# EAGLE design Shield (EAGLE 7.4.0)
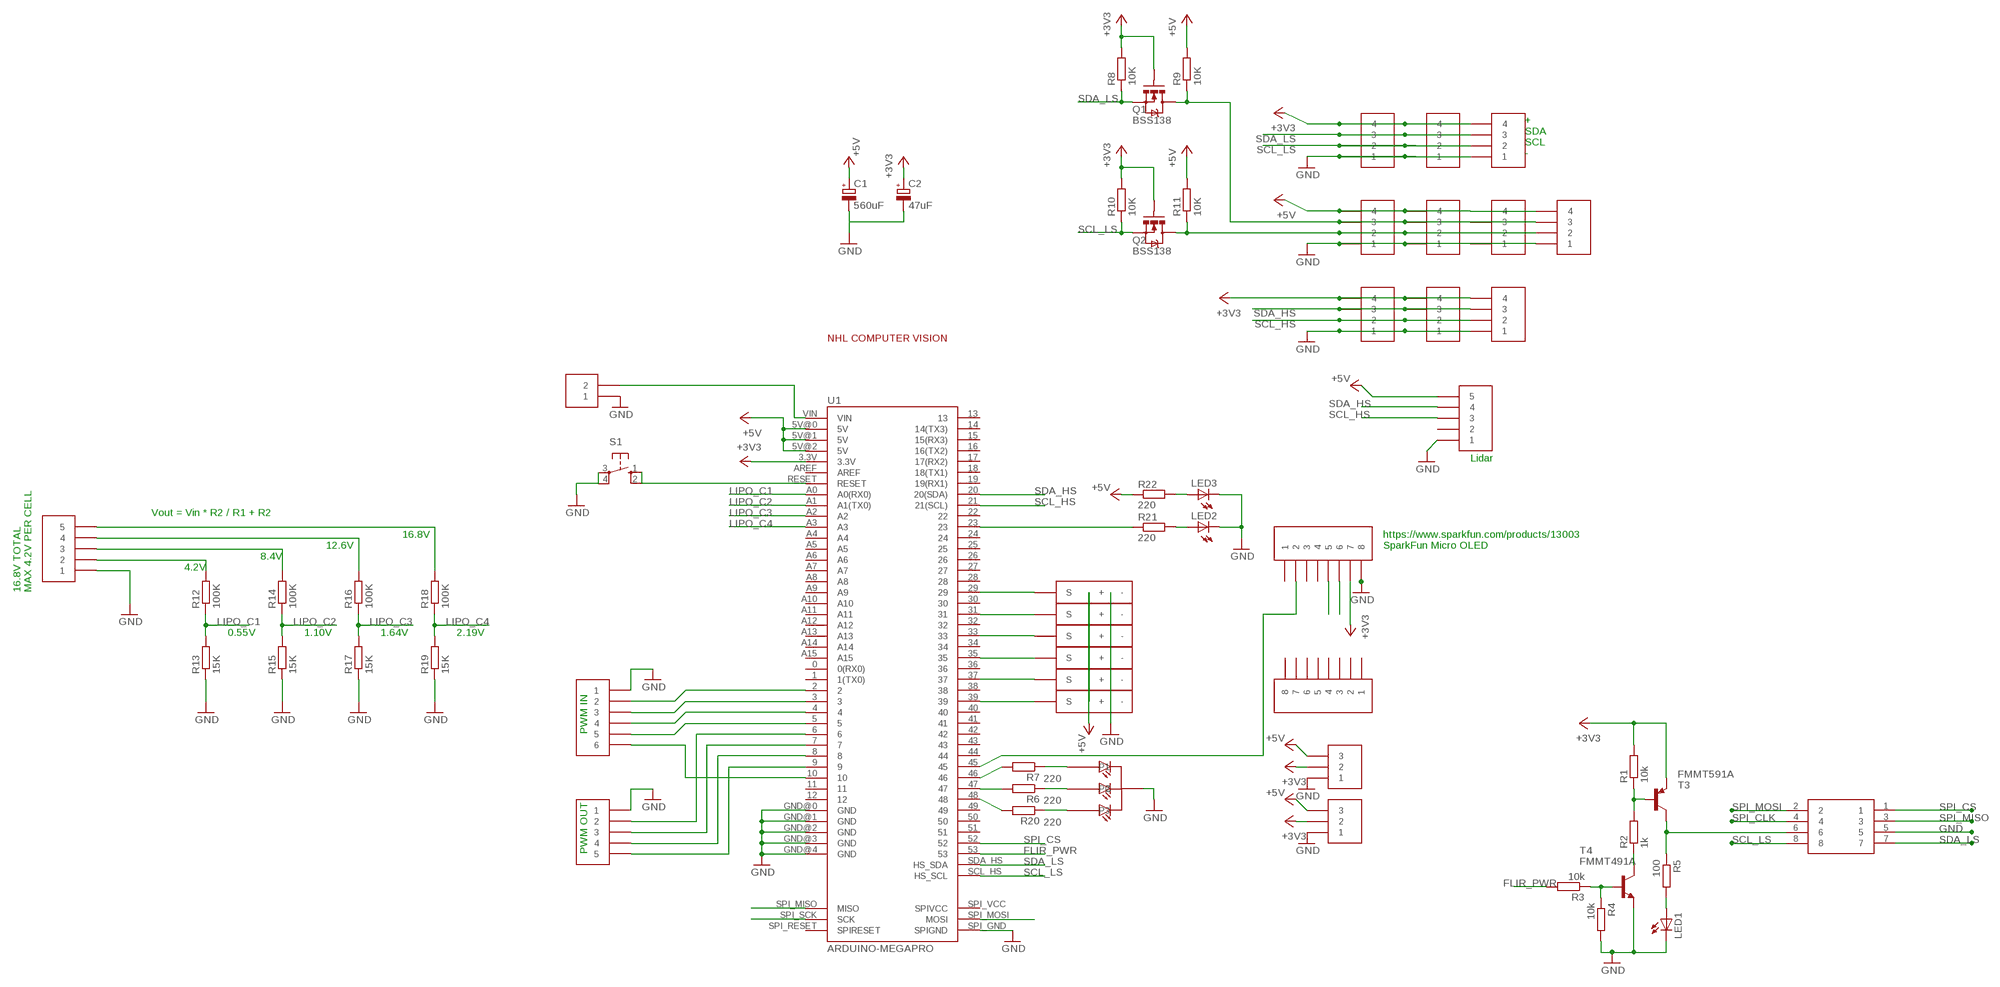
[diagram p0: schematic, sheet 1]

## Parts
C1  560uF  CPOL-EU153CLV-1010  [153CLV-1010]
C2  47uF  CPOL-EU153CLV-0605  [153CLV-0605]
LED1  LEDSML0805  [SML0805]
LED2  LEDSML0805  [SML0805]
LED3  LEDSML0805  [SML0805]
Q1  BSS138  MOSFET-NCHANNELBSS138  [SOT23-3]
Q2  BSS138  MOSFET-NCHANNELBSS138  [SOT23-3]
R1  10k  R-EU_R0805  [R0805]
R2  1k  R-EU_R0805  [R0805]
R3  10k  R-EU_R0805  [R0805]
R4  10k  R-EU_R0805  [R0805]
R5  100  R-EU_R0805  [R0805]
R6  220  R-EU_R0805  [R0805]
R7  220  R-EU_R0805  [R0805]
R8  10K  R-EU_R0805  [R0805]
R9  10K  R-EU_R0805  [R0805]
R10  10K  R-EU_R0805  [R0805]
R11  10K  R-EU_R0805  [R0805]
R12  100K  R-EU_R0805  [R0805]
R13  15K  R-EU_R0805  [R0805]
R14  100K  R-EU_R0805  [R0805]
R15  15K  R-EU_R0805  [R0805]
R16  100K  R-EU_R0805  [R0805]
R17  15K  R-EU_R0805  [R0805]
R18  100K  R-EU_R0805  [R0805]
R19  15K  R-EU_R0805  [R0805]
R20  220  R-EU_R0805  [R0805]
R21  220  R-EU_R0805  [R0805]
R22  220  R-EU_R0805  [R0805]
S1  10-XX  [B3F-10XX]
T3  FMMT591A  -PNP-SOT23-BCE  [SOT23-BCE]
T4  FMMT491A  BC808-NPN-SOT23-BEC  [SOT23-BEC]
U1  ARDUINO-MEGAPRO  [ARDUINO_MEGA-PRO-3.3V]
U$1  RGB5MMRGB5MM  [RGB5MM]
U$2  JST-4  [JST-4]
U$3  JST-4  [JST-4]
U$4  JST-4  [JST-4]
U$5  JST-4  [JST-4]
U$6  JST-4  [JST-4]
U$7  JST-4  [JST-4]
U$8  JST-4  [JST-4]
U$9  JST-4  [JST-4]
U$10  JST-4  [JST-4]
U$11  JST-4  [JST-4]
U$12  LIDAR  JST-5  [JST-5]
U$13  LIDAR  JST-5  [JST-5]
U$14  JST-3  [JST-3]
U$15  JST-3  [JST-3]
U$16  JST-2  [JST-2]
U$17  JST-6  [JST-6]
U$18  JST-5  [JST-5]
U$19  SERVOHEADER  [SERVOHEADER]
U$20  SERVOHEADER  [SERVOHEADER]
U$21  SERVOHEADER  [SERVOHEADER]
U$22  SERVOHEADER  [SERVOHEADER]
U$23  SERVOHEADER  [SERVOHEADER]
U$24  SERVOHEADER  [SERVOHEADER]
U$25  IDC-8WAY  [IDC-8WAY]
U$26  OLEDHEADER  [OLEDHEADER]
U$27  OLEDHEADER  [OLEDHEADER]
U$28  NHLLOGO  [NHLLOGO]

## Nets
+3V3: C2.+ Q1.1(G) Q2.1(G) R1.2 R8.2 R10.2 T3.E U1.3.3V U$2.4 U$3.4 U$4.4 U$8.4 U$9.4 U$10.4 U$14.2 U$15.2 U$26.P$7
+5V: C1.+ R9.2 R11.2 R22.1 U1.5V@0(5V) U1.5V@1(5V) U1.5V@2(5V) U$5.4 U$6.4 U$7.4 U$11.4 U$12.5 U$14.3 U$15.3 U$19.+ U$20.+ U$21.+ U$22.+ U$23.+ U$24.+
FLIR_PWR: R3.2 U1.53
GND: C1.- C2.- LED1.C LED2.C LED3.C R4.2 R13.1 R15.1 R17.1 R19.1 S1.3(P) S1.4(P1) T4.E U1.GND@0(GND) U1.GND@1(GND) U1.GND@2(GND) U1.GND@3(GND) U1.GND@4(GND) U1.SPI_GND(SPIGND) U$1.C U$2.1 U$3.1 U$4.1 U$5.1 U$6.1 U$7.1 U$8.1 U$9.1 U$10.1 U$11.1 U$12.1 U$13.1 U$14.1 U$15.1 U$16.1 U$17.1 U$18.1 U$19.- U$20.- U$21.- U$22.- U$23.- U$24.- U$25.5 U$26.P$8
LIPO_C1: R12.1 R13.2 U1.A0(A0(RX0))
LIPO_C2: R14.1 R15.2 U1.A1(A1(TX0))
LIPO_C3: R16.1 R17.2 U1.A2
LIPO_C4: R18.1 R19.2 U1.A3
N$1: R1.1 R2.2 T3.B
N$2: R2.1 T4.C
N$3: R3.1 R4.1 T4.B
N$4: LED1.A R5.2
N$5: U1.5 U$17.5
N$6: U1.4 U$17.4
N$7: R12.2 U$13.2
N$8: U1.3 U$17.3
N$9: U1.2 U$17.2
N$10: R14.2 U$13.3
N$11: R16.2 U$13.4
N$12: R18.2 U$13.5
N$13: U1.10 U$17.6
N$14: R20.2 U1.48
N$15: R6.2 U1.47
N$16: U1.6 U$18.2
N$17: U1.7 U$18.3
N$18: U1.8 U$18.4
N$19: U1.9 U$18.5
N$20: R7.2 U1.46
N$21: R20.1 U$1.P3
N$22: R6.1 U$1.P2
N$23: R7.1 U$1.P1
N$24: U1.45 U$26.P$2
N$25: U1.35 U$21.S
N$26: U1.33 U$22.S
N$27: U1.31 U$23.S
N$28: U1.39 U$19.S
N$29: U1.37 U$20.S
N$30: LED2.A R21.2
N$32: R21.1 U1.23
N$33: LED3.A R22.2
N$34: S1.1(S) S1.2(S1) U1.RESET
N$35: U1.VIN U$16.2
N$36: U1.29 U$24.S
SCL_HS: U1.21(21(SCL)) U$8.2 U$9.2 U$10.2 U$12.3
SCL_LS: Q2.2(S) R10.1 U1.SCL_HS(HS_SCL) U$2.2 U$3.2 U$4.2 U$25.8 U$26.P$5
SCL_LS_5: Q2.3(D) R11.1 U$5.2 U$6.2 U$7.2 U$11.2
SDA_HS: U1.20(20(SDA)) U$8.3 U$9.3 U$10.3 U$12.4
SDA_LS: Q1.2(S) R8.1 U1.SDA_HS(HS_SDA) U$2.3 U$3.3 U$4.3 U$25.7 U$26.P$6
SDA_LS_5: Q1.3(D) R9.1 U$5.3 U$6.3 U$7.3 U$11.3
SPI_CLK: U1.SPI_SCK(SCK) U$25.4
SPI_CS: U1.52 U$25.1
SPI_MISO: U1.SPI_MISO(MISO) U$25.3
SPI_MOSI: U1.SPI_MOSI(MOSI) U$25.2
SPI_VIN: R5.1 T3.C U$25.6
Unconnected: U1.0(0(RX0)) U1.1(1(TX0)) U1.11 U1.12 U1.13 U1.14(14(TX3)) U1.15(15(RX3)) U1.16(16(TX2)) U1.17(17(RX2)) U1.18(18(TX1)) U1.19(19(RX1)) U1.22 U1.24 U1.25 U1.26 U1.27 U1.28 U1.30 U1.32 U1.34 U1.36 U1.38 U1.40 U1.41 U1.42 U1.43 U1.44 U1.49 U1.50 U1.51 U1.A4 U1.A5 U1.A6 U1.A7 U1.A8 U1.A9 U1.A10 U1.A11 U1.A12 U1.A13 U1.A14 U1.A15 U1.AREF U1.SPI_RESET(SPIRESET) U1.SPI_VCC(SPIVCC) U$12.2 U$26.P$1 U$26.P$3 U$26.P$4 U$27.P$1 U$27.P$2 U$27.P$3 U$27.P$4 U$27.P$5 U$27.P$6 U$27.P$7 U$27.P$8

## Notes on the sheet
- +
- SDA
- SCL
- -
- Lidar
- Vout = Vin * R2 / R1 + R2
- 16.8V | https://www.sparkfun.com/products/13003
- 12.6V | SparkFun Micro OLED
- 8.4V
- 4.2V
- 16.8V TOTAL | MAX 4.2V PER CELL
- 0.55V | 1.10V | 1.64V | 2.19V
- PWM IN
- PWM OUT

## Library data of the parts
C1 C2 = resistor:CPOL-EU: POLARIZED CAPACITOR, European symbol
LED1-LED3 = led:LED: LED OSRAM: - CHIPLED LG R971, LG N971, LY N971, LG Q971, LY Q971, LO R971, LY R971 LH N974, LH R974 LS Q976, LO Q976, LY Q976 LO Q996 - Hyper CHIPLED LW Q18S LB Q993, LB Q99A, LB R99A - SideLED LS A670, LO A670, LY A670, LG A670, LP A670 LB A673, LV A673, LT A673, LW A673 LH A674 LY A675 LS A676, LA A676, LO A676, LY A676, LW A676 LS A679, LY A679, LG A679 - Hyper Micro SIDELED® LS Y876, LA Y876, LO Y876, LY Y876 LT Y87S - SmartLED LW L88C, LW L88S LB L89C, LB L89S, LG L890 LS L89K, LO L89K, LY L89K LS L896, LA L896, LO L896, LY L896 - TOPLED LS T670, LO T670, LY T670, LG T670, LP T670 LSG T670, LSP T670, LSY T670, LOP T670, LYG T670 LG T671, LOG T671, LSG T671 LB T673, LV T673, LT T673, LW T673 LH T674 LS T676, LA T676, LO T676, LY T676, LB T676, LH T676, LSB T676, LW T676 LB T67C, LV T67C, LT T67C, LS T67K, LO T67K, LY T67K, LW E67C LS E67B, LA E67B, LO E67B, LY E67B, LB E67C, LV E67C, LT E67C LW T67C LS T679, LY T679, LG T679 LS T770, LO T770, LY T770, LG T770, LP T770 LB T773, LV T773, LT T773, LW T773 LH T774 LS E675, LA E675, LY E675, LS T675 LS T776, LA T776, LO T776, LY T776, LB T776 LHGB T686 LT T68C, LB T68C - Hyper Mini TOPLED® LB M676 - Mini TOPLED Santana® LG M470 LS M47K, LO M47K, LY M47K Source: http://www.osram.convergy.de LUXEON: - LUMILED® LXK2-PW12-R00, LXK2-PW12-S00, LXK2-PW14-U00, LXK2-PW14-V00 LXK2-PM12-R00, LXK2-PM12-S00, LXK2-PM14-U00 LXK2-PE12-Q00, LXK2-PE12-R00, LXK2-PE12-S00, LXK2-PE14-T00, LXK2-PE14-U00 LXK2-PB12-K00, LXK2-PB12-L00, LXK2-PB12-M00, LXK2-PB14-N00, LXK2-PB14-P00, LXK2-PB14-Q00 LXK2-PR12-L00, LXK2-PR12-M00, LXK2-PR14-Q00, LXK2-PR14-R00 LXK2-PD12-Q00, LXK2-PD12-R00, LXK2-PD12-S00 LXK2-PH12-R00, LXK2-PH12-S00 LXK2-PL12-P00, LXK2-PL12-Q00, LXK2-PL12-R00 Source: www.luxeon.com KINGBRIGHT: KA-3528ASYC Source: www.kingbright.com
Q1 Q2 = SparkFun-DiscreteSemi:MOSFET-NCHANNEL: Common NMOSFET Parts MFG P/N Store ID Prod ID FDD8780 TRANS-09984 SI7820DN TRANS-11055 FDS6630A IC-08089 2N7002PW TRANS-11151 FQP30N06L COM-10213 TRANS-10060 BSS123LT1G TRANS-08345 BSS138 TRANS-00830 BS170 2N7000; PROD_ID: TRANS-00830; VALUE: 200mA/50V
R1-R22 = resistor:R-EU_: RESISTOR, European symbol
S1 = switch-omron:10-XX: OMRON SWITCH; MPN: B3F-1000; OC_FARNELL: 176432; OC_NEWARK: 36M3542
T3 = transistor:*-PNP-: PNP Transistror
T4 = transistor:*-NPN-: NPN Transistror BF959 corrected 2008.03.06
U1 = Arduino-Boards:ARDUINO-MEGA: Arduino Mega board footprint
U$1 = Arduino-Boards:RGB5MM
U$2-U$11 = Arduino-Boards:JST-4
U$12 U$13 U$18 = Arduino-Boards:JST-5
U$14 U$15 = Arduino-Boards:JST-3
U$16 = Arduino-Boards:JST-2
U$17 = Arduino-Boards:JST-6
U$19-U$24 = Arduino-Boards:SERVOHEADER
U$25 = Arduino-Boards:IDC-8WAY
U$26 U$27 = Arduino-Boards:OLEDHEADER
U$28 = Arduino-Boards:NHLLOGO

## Board
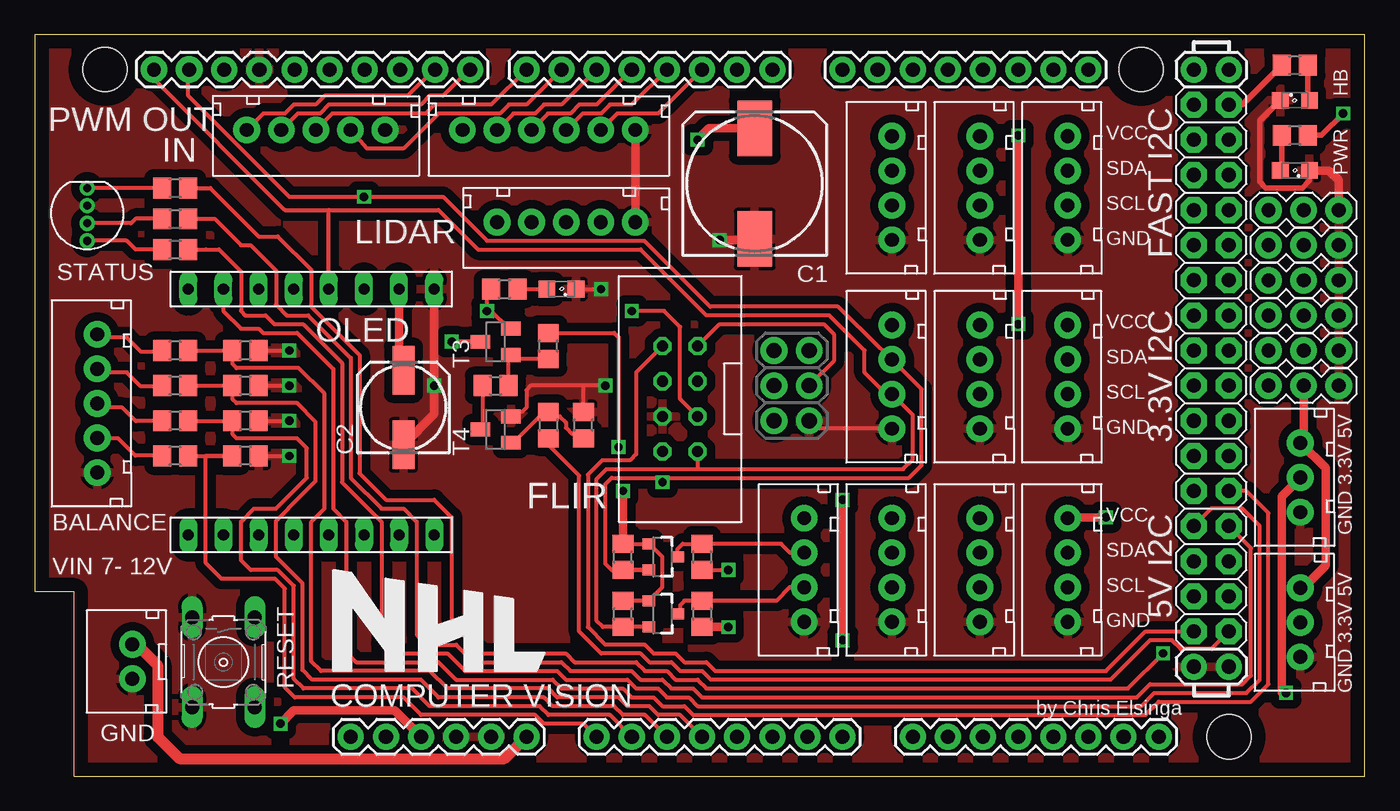
[diagram p1: board, top side]
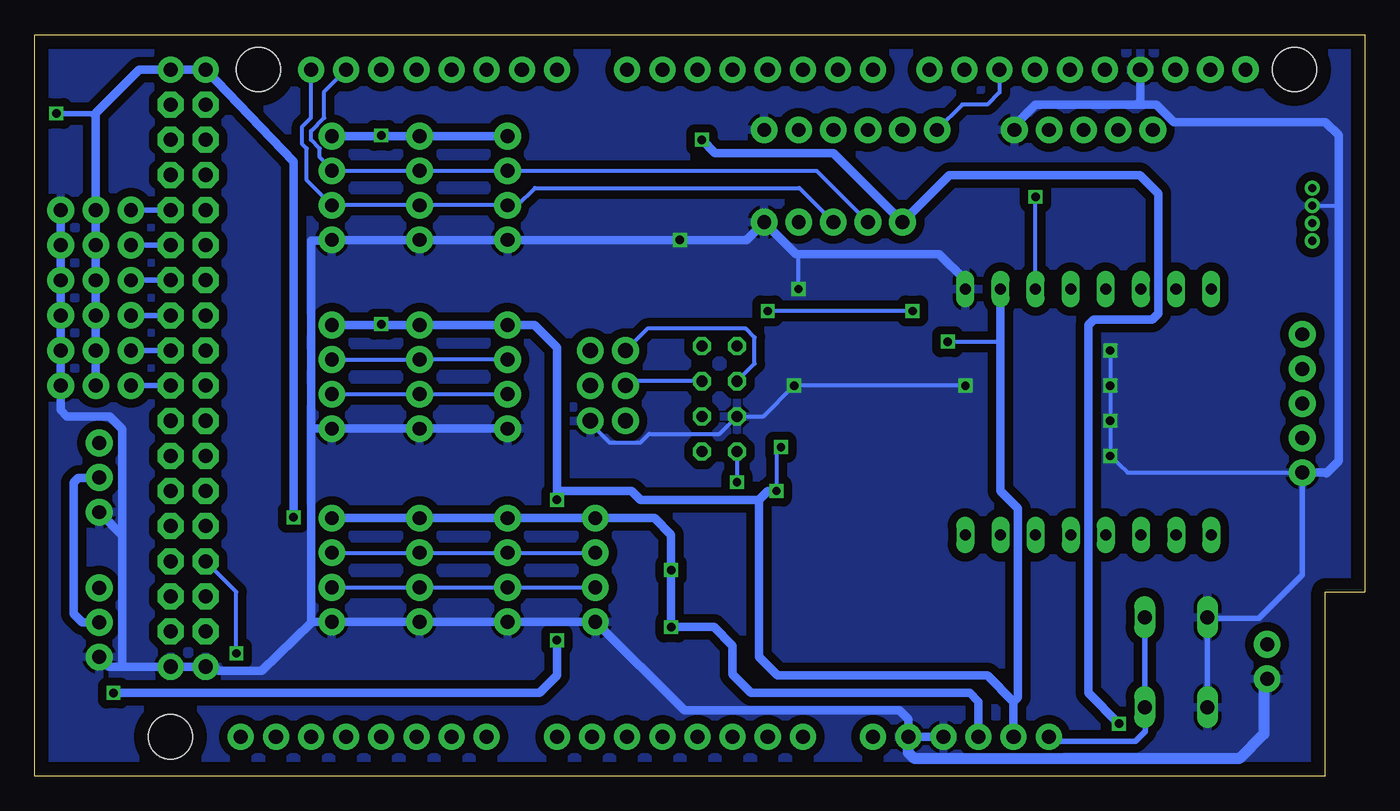
[diagram p2: board, bottom side, seen from below]

Size 96.19 x 53.65 mm. Coordinates in mm from the lower left corner, seen from the top.
Outline: 2.86,0 96.19,0 96.19,53.65 0,53.65 0,13.34 2.86,13.34 2.86,0
Copper layers (1*16): Top 0.035mm / dielectric 1.5mm / Bottom 0.035mm
Design rules "default *": minimum track width 10mil, minimum drill 20mil, track to track 8mil, track to pad 8mil, pad to pad 8mil, via to via 8mil, smd to smd 8mil, copper to edge 40mil, drill to drill 8mil, minimum pad ring 10mil, minimum via ring 8mil, stop-mask expansion 4mil, vias tented up to drill 0mil, thermal gap 10mil

### Footprints (pad centres in the part's own frame; a part is rotated, then mirrored left to right if it is on the bottom)
153CLV-1010 = smd 4 x 2.5: + 4,0; - -4,0
153CLV-0605 = smd 3.5 x 1.6: + 2.7,0; - -2.7,0
SML0805 = smd 1.2 x 1.2: A 1.05,0; C -1.05,0
SOT23-3 = smd 0.8 x 0.9: 1 -0.95,-1; 2 0.95,-1; 3 0,1.1
R0805 = smd 1.3 x 1.5: 1 -0.95,0; 2 0.95,0
B3F-10XX = drill 1.016 long: 1 -3.251,2.261; 2 3.251,2.261; 3 -3.251,-2.261; 4 3.251,-2.261
SOT23-BCE = smd 1 x 1.4: B -0.95,-1.1; C 0.95,-1.1; E 0,1.1
SOT23-BEC = smd 1 x 1.4: B -0.95,-1.1; C 0,1.1; E 0.95,-1.1
ARDUINO_MEGA-PRO-3.3V = drill 1.016 pad 1.88: 0 52.07,50.8; 1 49.53,50.8; 2 46.99,50.8; 3 44.45,50.8; 3.3V 24.13,2.54; 4 41.91,50.8; 5 39.37,50.8; 5V@0 26.67,2.54; 5V@1 82.55,50.8; 5V@2 85.09,50.8; 6 36.83,50.8; 7 34.29,50.8; 8 30.226,50.8; 9 27.686,50.8; 10 25.146,50.8; 11 22.606,50.8; 12 20.066,50.8; 13 17.526,50.8; 14 57.15,50.8; 15 59.69,50.8; 16 62.23,50.8; 17 64.77,50.8; 18 67.31,50.8; 19 69.85,50.8; 20 72.39,50.8; 21 74.93,50.8; A0 39.37,2.54; A1 41.91,2.54; A2 44.45,2.54; A3 46.99,2.54; A4 49.53,2.54; A5 52.07,2.54; A6 54.61,2.54; A7 57.15,2.54; A8 62.23,2.54; A9 64.77,2.54; A10 67.31,2.54; A11 69.85,2.54; A12 72.39,2.54; A13 74.93,2.54; A14 77.47,2.54; A15 80.01,2.54; AREF 12.446,50.8; GND@0 29.21,2.54; GND@1 31.75,2.54; GND@2 82.55,7.62; GND@3 85.09,7.62; GND@4 14.986,50.8; RESET 21.59,2.54; VIN 34.29,2.54 | drill 1.016 pad 1.88 octagon: 22 82.55,48.26; 23 85.09,48.26; 24 82.55,45.72; 25 85.09,45.72; 26 82.55,43.18; 27 85.09,43.18; 28 82.55,40.64; 29 85.09,40.64; 30 82.55,38.1; 31 85.09,38.1; 32 82.55,35.56; 33 85.09,35.56; 34 82.55,33.02; 35 85.09,33.02; 36 82.55,30.48; 37 85.09,30.48; 38 82.55,27.94; 39 85.09,27.94; 40 82.55,25.4; 41 85.09,25.4; 42 82.55,22.86; 43 85.09,22.86; 44 82.55,20.32; 45 85.09,20.32; 46 82.55,17.78; 47 85.09,17.78; 48 82.55,15.24; 49 85.09,15.24; 50 82.55,12.7; 51 85.09,12.7; 52 82.55,10.16; 53 85.09,10.16 | drill 1 pad 1.93: SCL_HS 7.366,50.8; SDA_HS 9.906,50.8 | drill 1.1 pad 1.93: SPI_GND 54.737,25.4; SPI_MISO 52.197,30.48; SPI_MOSI 54.737,27.94; SPI_RESET 52.197,25.4; SPI_SCK 52.197,27.94; SPI_VCC 54.737,30.48 | hole 3.2: 3.81,50.8; 78.74,50.8; 85.09,2.54
RGB5MM = drill 0.6: C 1.27,0; P1 -1.27,0; P2 0,0; P3 2.54,0
JST-4 = drill 1 pad 1.93: 1 -3.75,-0.4; 2 -1.25,-0.4; 3 1.25,-0.4; 4 3.75,-0.4
JST-5 = drill 1 pad 1.93: 1 -3.75,-0.4; 2 -1.25,-0.4; 3 1.25,-0.4; 4 3.75,-0.4; 5 6.25,-0.4
JST-3 = drill 1 pad 1.93: 1 -3.75,-0.4; 2 -1.25,-0.4; 3 1.25,-0.4
JST-2 = drill 1 pad 1.93: 1 -3.75,-0.4; 2 -1.25,-0.4
JST-6 = drill 1 pad 1.93: 1 -3.75,-0.4; 2 -1.25,-0.4; 3 1.25,-0.4; 4 3.75,-0.4; 5 6.25,-0.4; 6 8.75,-0.4
SERVOHEADER = drill 1 pad 1.93: + 0,0; - 2.54,0; S -2.54,0
IDC-8WAY = drill 0.8 octagon: 1 -1.27,3.81; 2 1.27,3.81; 3 -1.27,1.27; 4 1.27,1.27; 5 -1.27,-1.27; 6 1.27,-1.27; 7 -1.27,-3.81; 8 1.27,-3.81
OLEDHEADER = drill 0.8 long: P$1 -8.89,1.27; P$2 -6.35,1.27; P$3 -3.81,1.27; P$4 -1.27,1.27; P$5 1.27,1.27; P$6 3.81,1.27; P$7 6.35,1.27; P$8 8.89,1.27

### Placement (x,y rotation side)
C1  52.07,42.86 90 top
C2  26.67,26.67 90 top
LED1  38.1,35.24 180 top
LED2  91.12,48.9 0 top
LED3  91.12,43.82 180 top
Q1  45.4,15.88 270 top
Q2  45.4,11.75 270 top
R1  37.15,31.11 90 top
R2  33.34,28.26 0 top
R3  37.15,25.4 270 top
R4  39.69,25.4 90 top
R5  33.97,35.24 0 top
R6  10.16,40.32 0 top
R7  10.16,38.1 0 top
R8  42.55,15.88 90 top
R9  48.26,15.88 270 top
R10  42.55,11.75 90 top
R11  48.26,11.75 270 top
R12  10.16,23.18 180 top
R13  15.24,23.18 180 top
R14  10.16,25.72 180 top
R15  15.24,25.72 180 top
R16  10.16,28.26 180 top
R17  15.24,28.26 180 top
R18  10.16,30.8 180 top
R19  15.24,30.8 180 top
R20  10.16,42.55 0 top
R21  91.12,51.44 0 top
R22  91.12,46.36 180 top
S1  13.65,8.26 270 top
T3  33.34,31.43 90 top
T4  33.34,25.08 90 top
U1  1.27,0.32 0 top
U$1  3.81,40.01 90 top
U$2  74.3,28.89 90 top
U$3  67.94,28.89 90 top
U$4  61.6,28.89 90 top
U$5  74.3,14.92 90 top
U$6  67.94,14.92 90 top
U$7  61.6,14.92 90 top
U$8  74.3,42.55 90 top
U$9  67.94,42.55 90 top
U$10  61.6,42.55 90 top
U$11  55.25,14.92 90 top
U$12  39.69,39.69 180 top
U$13  4.13,25.72 90 top
U$14  91.12,22.86 90 top
U$15  91.12,12.38 90 top
U$16  6.67,10.79 90 top
U$17  39.69,46.36 180 top
U$18  21.59,46.36 180 top
U$19  91.76,28.26 0 top
U$20  91.76,30.8 0 top
U$21  91.76,33.34 0 top
U$22  91.76,35.88 0 top
U$23  91.76,38.42 0 top
U$24  91.76,40.96 0 top
U$25  46.67,27.3 0 top
U$26  20,33.97 0 top
U$27  20,18.73 180 top
U$28  21.59,14.92 0 top

### Tracks (layer width: path | path; a pad name or v marks a point on that pad's centre or on a via)
+3V3  (via drill 0.6)
  Top 0.305: R8.2 Q1.1 44.45,16.83 45.4,15.87 45.4,13.7 Q2.1 R10.2 | R1.2 41.91,32.06 42.23,31.75 v42.23,23.81 | T3.E v30.16,31.43
  Top 0.61: v71.12,32.7 v71.12,46.36 | R8.2 v42.55,20.64 | U$14.2 90.17,20.26 90.17,6.03 v90.49,6.03 | v58.42,9.84 v58.42,20 | C2.+ 26.35,30.32 U$26.P$7
  Bottom 0.305: v42.23,23.81 42.55,23.49 v42.55,20.64 | v30.16,31.43 26.35,31.43 26.35,31.75
  Bottom 0.61: U1.3.3V 25.4,5.4 | 25.4,5.4 27.3,7.3 42.47,7.3 43.82,8.65 43.82,20 | U$8.4 71.12,46.29 | 71.12,46.29 U$9.4 U$10.4 | 71.12,32.64 U$3.4 U$4.4 60.04,32.64 58.42,31.02 58.42,20.64 | U$2.4 71.12,32.64 | 71.12,32.64 v71.12,32.7 | v71.12,46.36 71.12,46.29 | v42.55,20.64 43.18,20.64 43.82,20 | 43.82,20 52.39,20 53.02,20.64 58.42,20.64 | U$26.P$7 26.35,31.75 26.35,20.64 25.08,19.37 25.08,5.71 25.4,5.4 | U$14.2 91.54,21.59 93.03,21.59 93.34,21.27 93.34,11.75 92.73,11.13 U$15.2 | v90.49,6.03 59.69,6.03 58.42,7.3 v58.42,9.84 | v58.42,20 58.42,20.64
+5V  (via drill 0.6)
  Top 0.305: R11.2 | R9.2 49.53,14.92 v50.17,14.92
  Top 0.406: R22.1 93.03,46.36 v94.61,47.94
  Top 0.61: v77.47,18.73 74.75,18.73 U$5.4 | v17.78,3.81 18.73,4.76 26.04,4.76 U1.5V@0 | U$15.3 91.52,13.42 93.34,15.24 93.34,22.29 U$14.3 91.76,24.11 U$19.+ | R11.2 v50.16,10.8 v50.17,10.79 | C1.+ 48.77,46.86 v47.94,46.04
  Bottom 0.305: U$7.4 61.91,18.67
  Bottom 0.406: v94.61,47.94 92.08,47.94 91.76,47.62
  Bottom 0.61: U1.5V@0 27.94,5.4 28.57,6.03 44.37,6.03 45.72,7.38 45.72,9.45 47.07,10.79 v50.17,10.79 v50.17,14.92 50.17,17.46 51.38,18.67 U$11.4 61.91,18.67 | v77.47,18.73 77.47,44.45 U1.5V@1 U1.5V@2 88.61,51.12 91.76,47.97 91.76,47.62 U$24.+ U$23.+ U$22.+ U$21.+ U$20.+ U$19.+ | U$5.4 U$6.4 U$7.4 | v17.78,3.81 20,6.03 20,32.63 19.61,33.02 15.37,33.02 14.92,33.47 14.92,42.15 16.27,43.5 30.03,43.5 U$12.5 38.44,45.08 46.99,45.08 v47.94,46.04
FLIR_PWR
  Top 0.305: R3.2 37.15,23.98 39.14,21.99 39.37,21.76 39.37,10.48 40.96,8.89 43.82,8.89 44.45,8.26 46.04,8.26 46.67,7.62 48.26,7.62 48.9,6.99 77.79,6.99 80.64,9.84 82.23,9.84 82.87,9.21 85.09,9.21 U1.53
GND  (via drill 0.6)
  Top 0.305: 39.69,28.26 35.88,28.26 35.56,27.94 35.56,26.67 35.24,26.35 34.44,26.35 T4.E | R4.2 39.69,28.26 | R13.1 v18.41,23.18 | R15.1 v18.41,25.72 | R17.1 v18.41,28.26 | R19.1 v18.41,30.8 | U$4.1 56.58,25.14 U1.SPI_GND | v41.28,28.26 39.69,28.26 | LED1.C v40.96,35.24
  Top 0.406: LED3.C 92.17,43.07 91.65,42.54 89.03,42.54 88.58,42.99 88.58,47.4 LED2.C
  Top 0.61: U$24.- 94.3,43.11 93.59,43.82 LED3.C | C2.- 28.89,26.19 v28.89,28.26 U$26.P$8 | C1.- 52,38.79 v49.53,38.79 | U$17.1 U$12.1
  Bottom 0.305: v18.41,30.8 v18.41,28.26 v18.41,25.72 v18.41,23.18 17.14,21.97 U$13.1 | U$1.C 1.91,41.28 | U1.SPI_GND 56.01,25.53 54.61,24.13 52.39,24.13 51.75,24.77 46.67,24.77 U$25.5 43.5,26.04 v41.28,28.26 v28.89,28.26 | v40.96,35.24 40.96,37.47 40.64,37.78
  Bottom 0.406: S1.4 S1.3 11.39,11.43 7.62,11.43 7.62,11.47 4.53,14.56 U$13.1
  Bottom 0.61: U1.GND@0 U1.GND@1 33.02,4.13 33.66,4.76 49.21,4.76 55.62,11.17 U$11.1 U$7.1 U$6.1 U$5.1 | U$4.1 U$3.1 U$2.1 76.2,25.14 76.2,26.04 | U$5.1 76.14,11.17 76.2,11.11 79.77,7.62 82.87,7.62 83.19,7.94 U1.GND@2 U1.GND@3 89.85,7.94 | U$5.1 76.2,11.17 76.2,38.73 74.69,38.73 U$8.1 U$9.1 U$10.1 v49.53,38.79 44.73,38.79 U$12.1 41.13,37.78 40.64,37.78 30.8,37.78 28.89,35.88 U$26.P$8 | U$13.1 2.8,21.97 2.8,21.91 1.91,22.81 1.91,41.28 1.91,46.36 2.86,47.31 13.8,47.31 15.07,48.58 16.51,48.58 | U$15.1 90.83,7.94 89.85,7.94 | U$14.1 89.85,17.44 | 89.85,17.44 89.85,7.94 | 89.85,17.44 89.85,25.14 90.75,26.04 93.85,26.04 94.3,26.48 U$19.- U$20.- U$21.- U$22.- U$23.- U$24.- | U$18.1 25.34,47.05 23.81,48.58 16.51,48.58 | U1.GND@4 16.26,48.83 16.51,48.58
  Bottom 0.813: U$16.1 7.3,7.13 7.3,3.07 9.1,1.27 32.57,1.27 33.02,1.72 U1.GND@1
  pour Top (isolate 0.61): 0.32,53.66 96.2,53.66 96.2,0 2.86,0 2.86,13.34 0,13.34 0,53.66
  pour Bottom (isolate 0.61): 0,53.66 96.2,53.66 96.2,0 2.86,0 2.86,13.34 0,13.34
LIPO_C1
  Top 0.305: R12.1 12.38,23.18 | 12.38,23.18 R13.2 12.38,23.18 | U1.A0 39.69,3.81 36.83,3.81 36.2,4.45 27.94,4.45 26.67,5.71 18.81,5.71 18.1,6.42 18.1,13.58 17.39,14.29 13.53,14.29 12.38,15.43 12.38,23.18
LIPO_C2
  Top 0.305: R14.1 R15.2 14.29,24.77 14.61,24.45 18.97,24.45 19.68,23.74 19.68,21.59 17.46,19.37 15.88,19.37 14.92,18.42 14.92,15.63 15.63,14.92 17.59,14.92 18.73,13.78 18.73,7.06 19.44,6.35 27.3,6.35 28.57,5.08 36.51,5.08 37.15,4.45 41.59,4.45 U1.A1
LIPO_C3
  Top 0.305: R16.1 R17.2 14.29,27.31 14.61,26.99 18.97,26.99 20.32,25.64 20.32,21.35 18.34,19.37 18.36,19.37 17.46,18.47 17.46,15.87 19.37,13.97 19.37,7.69 20.08,6.99 27.94,6.99 29.21,5.71 36.83,5.71 37.47,5.08 41.91,5.08 42.55,4.45 44.13,4.45 U1.A2
LIPO_C4
  Top 0.305: R18.1 R19.2 14.29,30.18 14.29,29.84 14.61,29.53 19.1,29.53 20.95,27.68 20.95,19.37 20,18.42 20,8.33 20.71,7.62 28.57,7.62 29.84,6.35 37.15,6.35 37.78,5.71 42.23,5.71 42.86,5.08 44.45,5.08 45.09,4.45 46.67,4.45 U1.A3
N$1
  Top 0.305: R2.2 34.29,30.48 T3.B 34.44,30.17 R1.1
N$2
  Top 0.305: R2.1 32.39,25.08 T4.C
N$3
  Top 0.305: R4.1 39.69,24.77 38.87,24.77 38.42,25.21 38.42,25.59 37.97,26.04 37.47,26.04 37.47,26.35 R3.1 36.83,26.35 34.93,24.45 34.93,24.13 T4.B
N$4
  Top 0.305: R5.2 LED1.A
N$5
  Top 0.305: U1.5 38.1,48.58 36.83,48.58 36.2,47.94 34.62,47.94 U$17.5
N$6
  Top 0.305: U1.4 40.64,48.58 39.37,48.58 38.74,47.94 37.12,47.94 U$17.4
N$7
  Top 0.305: R12.2 9.21,23.2 7.28,23.2 6.03,24.45 4.45,24.45 U$13.2
N$8
  Top 0.305: U1.3 43.18,48.58 41.59,48.58 40.96,47.94 39.62,47.94 U$17.3
N$9
  Top 0.305: U1.2 45.09,47.94 42.12,47.94 U$17.2
N$10
  Top 0.305: R14.2 9.21,25.7 7.32,25.7 6.35,26.67 4.45,26.67 U$13.3
N$11
  Top 0.305: R16.2 9.21,28.2 7.68,28.2 6.67,29.21 4.45,29.21 U$13.4
N$12
  Top 0.305: R18.2 9.21,30.7 7.72,30.7 6.67,31.75 4.45,31.75 U$13.5
N$13
  Bottom 0.305: U1.10 26.42,49.47 27.3,48.58 29.11,48.58 U$17.6
N$14  (via drill 0.6)
  Top 0.305: R20.2 12.7,42.54 16.19,39.05 17.58,39.05 20,36.63 20,33.97 23.5,30.48 23.5,21.91 25.4,20 28.89,20 30.16,18.73 30.16,11.06 31.06,10.16 31.11,10.16 32.38,8.89 38.42,8.89 39.05,8.26 43.5,8.26 44.13,7.62 45.72,7.62 46.36,6.99 47.94,6.99 48.58,6.35 79.06,6.35 v81.6,8.89
  Bottom 0.305: v81.6,8.89 81.6,13.34 U1.48
N$15
  Top 0.305: R6.2 13.02,40.32 14.92,38.42 15.61,38.42 17.46,36.57 17.46,34.1 18.23,33.34 19.79,33.34 22.86,30.27 22.86,21.59 25.08,19.37 26.67,19.37 27.62,18.42 27.62,10.23 28.33,9.52 30.48,9.52 31.75,8.26 38.1,8.26 38.74,7.62 43.18,7.62 43.82,6.99 45.4,6.99 46.04,6.35 47.62,6.35 48.26,5.71 79.69,5.71 80.64,6.67 87.31,6.67 87.95,7.3 87.95,16.51 U1.47
N$16
  Top 0.305: U1.6 35.56,48.58 34.29,48.58 33.66,47.94 29.21,47.94 26.67,45.4 24.03,45.4 U$18.2
N$17
  Top 0.305: U1.7 33.02,48.58 28.89,48.58 28.26,47.94 21.53,47.94 U$18.3
N$18
  Top 0.305: U1.8 31.43,51.12 29.53,49.21 28.57,49.21 27.94,48.58 21.27,48.58 20.64,47.94 19.03,47.94 U$18.4
N$19
  Top 0.305: U1.9 28.89,51.12 26.99,49.21 20.95,49.21 20.32,48.58 18.73,48.58 18.1,47.94 16.53,47.94 U$18.5
N$20
  Top 0.305: R7.2 12.38,38.1 13.33,38.1 14.92,36.51 14.92,33.65 15.24,33.34 16.7,33.34 17.33,32.7 19.41,32.7 22.22,29.89 22.22,21.27 25.08,18.42 25.08,9.6 25.79,8.89 29.84,8.89 31.11,7.62 37.78,7.62 38.42,6.99 42.86,6.99 43.5,6.35 45.09,6.35 45.72,5.71 47.31,5.71 47.94,5.08 80.01,5.08 80.96,6.03 87.63,6.03 88.58,6.99 88.58,18.1 87.31,19.37 85.09,19.37 U1.46
N$21
  Top 0.305: R20.1 U$1.P3
N$22
  Top 0.305: R6.1 7.3,40.32 6.98,40.01 U$1.P2
N$23
  Top 0.305: R7.1 7.3,38.1 6.67,38.73 U$1.P1
N$24
  Top 0.305: U$26.P$2 13.65,33.65 14.92,32.39 16.19,32.39 16.51,32.07 18.98,32.07 21.59,29.46 21.59,19.37 22.54,18.42 22.54,8.96 23.25,8.26 29.21,8.26 30.48,6.99 37.47,6.99 38.1,6.35 42.55,6.35 43.18,5.71 44.77,5.71 45.4,5.08 46.99,5.08 47.62,4.45 80.33,4.45 81.28,5.4 87.95,5.4 89.22,6.67 89.22,19.05 87.63,20.64 U1.45
N$25
  Bottom 0.406: U1.35 U$21.S
N$26
  Bottom 0.406: U$22.S U1.33
N$27
  Bottom 0.406: U1.31 U$23.S
N$28
  Bottom 0.406: U1.39 U$19.S
N$29
  Bottom 0.406: U$20.S U1.37
N$30
  Top 0.406: 92.07,49 R21.2
  Top 0.61: LED2.A 92.07,49
N$32
  Top 0.406: R21.1 87.31,48.58 U1.23
N$33
  Top 0.406: 90.17,43.91 R22.2
  Top 0.61: LED3.A 90.17,43.91
N$34
  Bottom 0.406: U1.RESET 22.54,2.54 16.6,2.54 15.89,3.26 15.91,4.8 S1.2 S1.1
N$35
  Top 0.813: U$16.2 7.09,9.84 8.89,8.04 8.89,2.86 10.48,1.27 33.97,1.27 U1.VIN
N$36
  Bottom 0.406: U$24.S U1.29
SCL_HS
  Bottom 0.305: U1.21 76.2,47.62 76.83,46.99 76.83,45.72 76.52,45.4 76.52,43.12 U$8.2 U$9.2 U$10.2 61.26,41.29 60.01,42.54 40.9,42.54 U$12.3
SCL_LS
  Top 0.305: R10.1 Q2.2 41.09,10.79 40.64,11.24 40.64,21.52 41.35,22.22 47.94,22.22 | 47.94,22.22 62.79,22.22 63.5,22.93 63.5,26.14 U$4.2 62,27.54 61.68,27.54 60.01,29.21 60.01,30.8 57.47,33.34 48.58,33.34 43.82,38.1 32.07,38.1 29.21,40.96 21.27,40.96 | 21.27,40.96 18.1,40.96 8.57,50.48 8.57,51.05 U1.SCL_HS | U$26.P$5 21.27,40.96 | U$25.8 47.94,22.22
  Bottom 0.305: U$2.2 U$3.2 U$4.2
SCL_LS_5
  Top 0.305: U$11.2 54.59,13.67 53.66,12.7 R11.1 | R11.1 | R11.1 46.99,12.7 46.67,12.38 46.67,11.92 Q2.3
  Bottom 0.305: U$5.2 U$6.2 U$7.2 U$11.2
SDA_HS
  Bottom 0.305: U1.20 75.25,49.53 75.25,47.62 76.2,46.67 76.2,46.04 75.56,45.4 75.56,44.77 74.69,43.9 U$8.3 U$9.3 U$10.3 39.65,43.79 U$12.4
SDA_LS  (via drill 0.6)
  Top 0.305: R8.1 Q1.2 42.5,14.92 41.72,14.92 41.28,15.37 41.28,21.14 41.72,21.59 45.4,21.59 | 45.4,21.59 63.24,21.59 64.14,22.49 64.14,28 U$4.3 58.74,33.34 58.1,33.97 48.84,33.97 44.08,38.73 32.7,38.73 29.53,41.91 v23.81,41.91 18.41,41.91 11.11,49.21 11.11,51.05 U1.SDA_HS | v45.4,21.27 45.4,21.59
  Bottom 0.305: U$2.3 U$3.3 U$4.3 | U$26.P$6 v23.81,41.91 | U$25.7 v45.4,21.27
SDA_LS_5
  Top 0.305: Q1.3 46.5,16.47 46.86,16.83 R9.1 | R9.1 | U$11.3 54.63,16.17 53.98,16.83 R9.1
  Bottom 0.305: U$5.3 U$6.3 U$7.3 U$11.3
SPI_CLK
  Bottom 0.305: U$25.4 53.47,28.58 U1.SPI_SCK
SPI_CS
  Top 0.305: U1.52 80.33,10.48 77.47,7.62 49.21,7.62 48.58,8.26 46.99,8.26 46.36,8.89 44.77,8.89 44.13,9.52 41.28,9.52 40.01,10.79 40.01,21.83 41.04,22.86 43.05,22.86 43.5,23.31 43.5,29.21 U$25.1
SPI_MISO
  Bottom 0.305: U$25.3 44.13,29.84 44.13,31.75 44.77,32.39 51.88,32.39 U1.SPI_MISO
SPI_MOSI
  Top 0.305: U$25.2 49.53,32.7 57.08,32.7 57.79,31.99 57.79,30.04 U1.SPI_MOSI
SPI_VIN  (via drill 0.6)
  Top 0.305: R5.1 32.7,35.24 v32.7,33.65 33.02,33.65 34.29,32.38 T3.C | U$25.6 46.67,27.31 46.67,32.51 45.53,33.65 v43.18,33.65
  Bottom 0.305: v32.7,33.65 v43.18,33.65

### Text on the board
tNames: HB | PWM OUT | VCC | IN | SDA | PWR | SCL | LIDAR | GND | FAST I2C | STATUS | VCC | OLED | SDA | SCL | GND | 3.3V I2C | FLIR | VCC | BALANCE | GND 3.3V 5V | SDA | VIN 7- 12V | SCL | 5V I2C | GND | RESET | GND 3.3V 5V | by Chris Elsinga | GND